# EAGLE schematic carl ripup  2v42 (EAGLE 7.4.0)
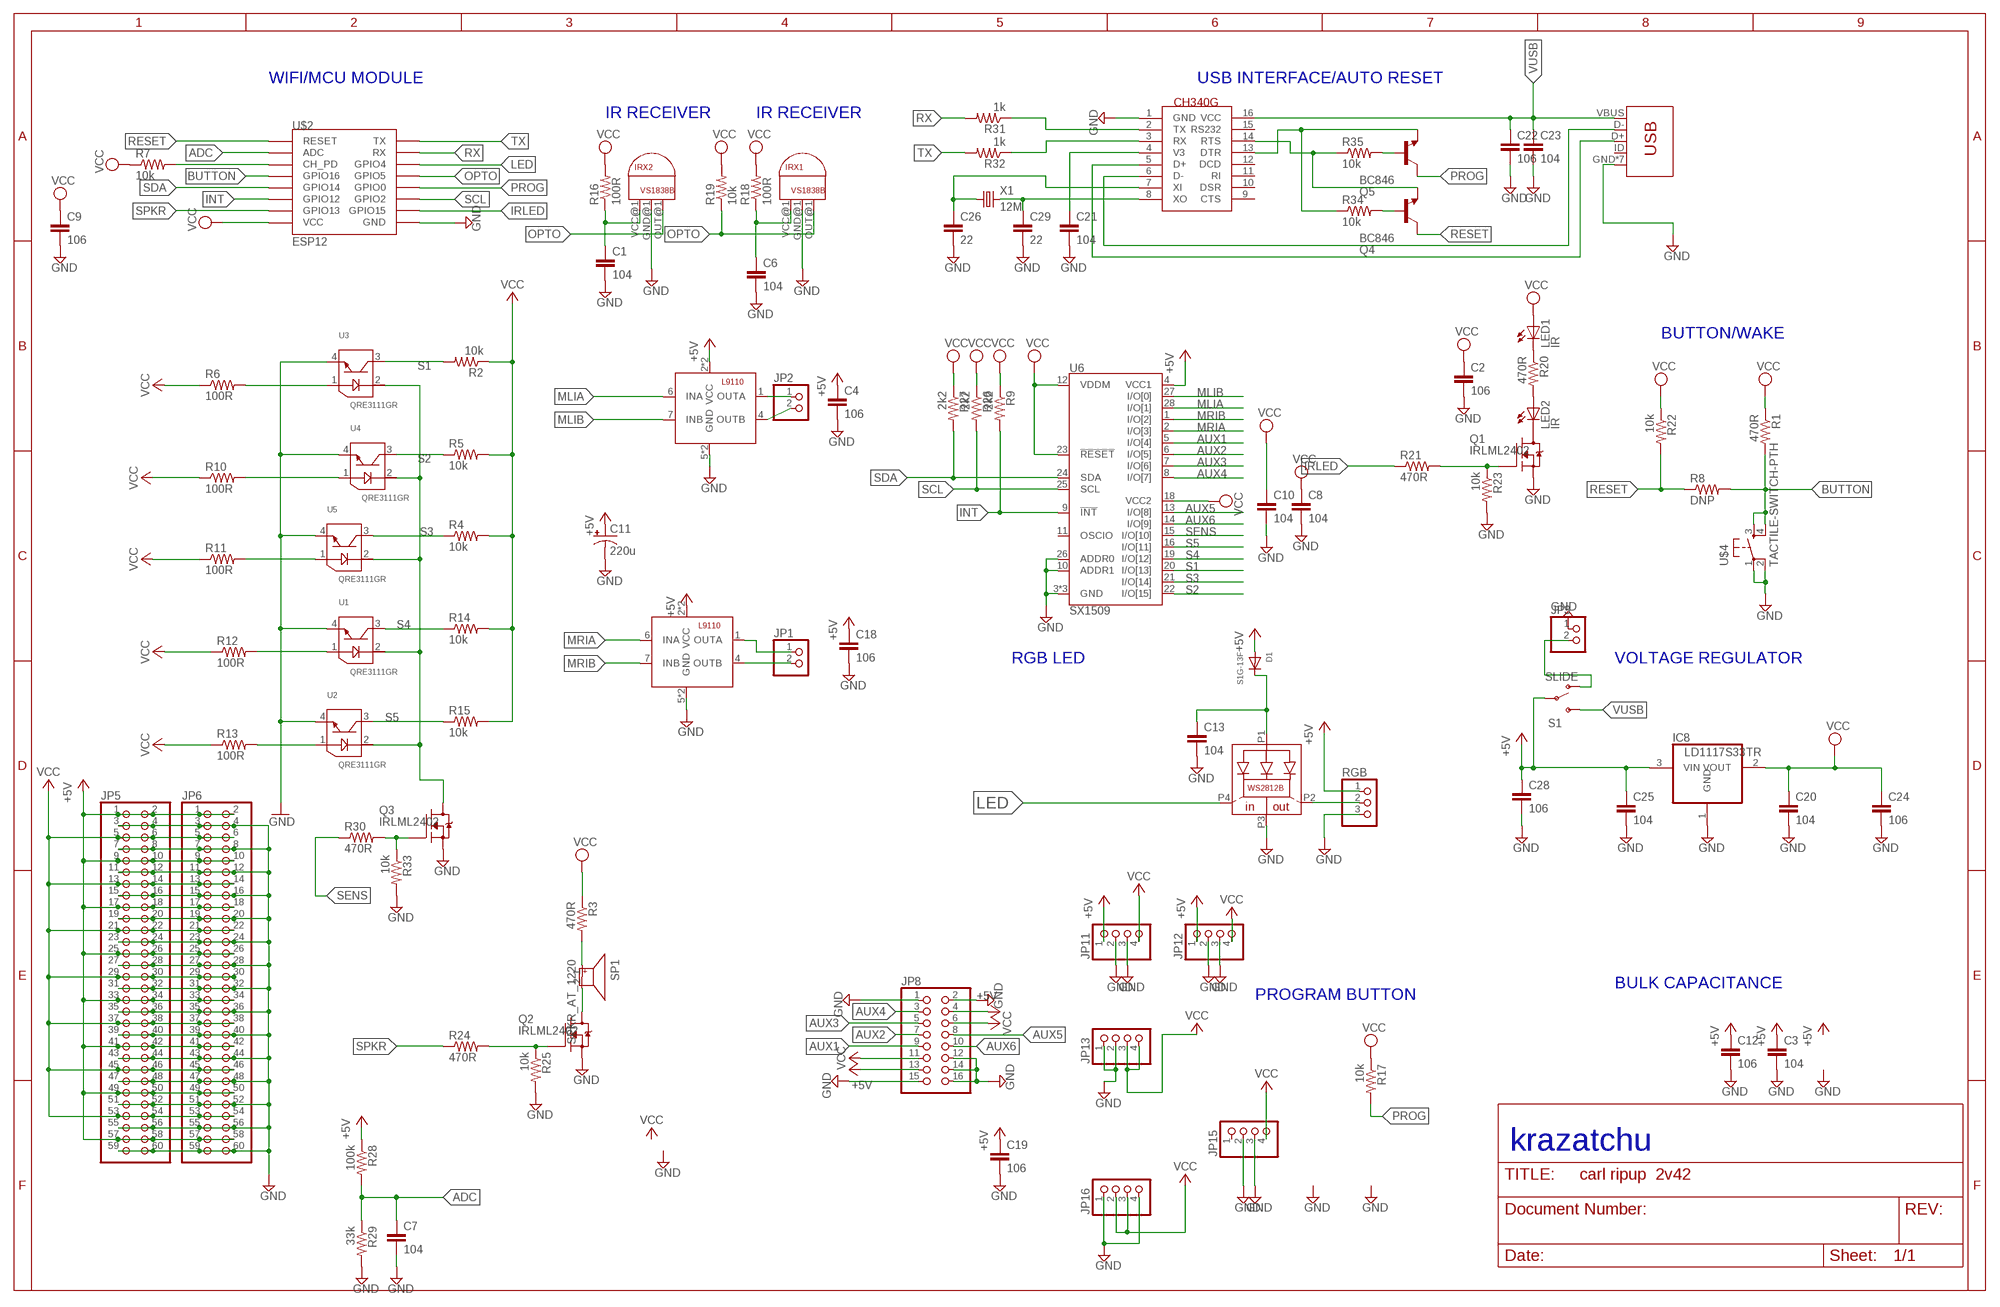
[diagram p0: schematic, sheet 1]

## Parts
C1  104  C-EUC0805  [C0805]
C2  106  C-EUC0805  [C0805]
C3  104  C-EUC0805  [C0805]
C4  106  C-EUC0805  [C0805]
C6  104  C-EUC0805  [C0805]
C7  104  C-EUC0805  [C0805]
C8  104  C-EUC0805  [C0805]
C9  106  C-EUC0805  [C0805]
C10  104  C-EUC0805  [C0805]
C11  220u  CPOL-US140CLH-0810  [140CLH-0810]
C12  106  C-EUC0805  [C0805]
C13  104  C-EUC0805  [C0805]
C18  106  C-EUC0805  [C0805]
C19  106  C-EUC0805  [C0805]
C20  104  C-EUC0805  [C0805]
C21  104  C-EUC0805  [C0805]
C22  106  C-EUC0805  [C0805]
C23  104  C-EUC0805  [C0805]
C24  106  C-EUC0805  [C0805]
C25  104  C-EUC0805  [C0805]
C26  22  C-EUC0805  [C0805]
C28  106  C-EUC0805  [C0805]
C29  22  C-EUC0805  [C0805]
D1  S1G-13F  DIODESMA  [SMADIODE]
IC1  L9110  [SOIC8]
IC2  L9110  [SOIC8]
IC8  LD1117S33TR  REG1117  [SOT223]
IRX1  VS1838B  IR-RX  [IR-RX-SINGLE]
IRX2  VS1838B  IR-RX  [IR-RX-SINGLE]
JP1  PINHD-1X2  [1X02]
JP2  PINHD-1X2  [1X02]
JP3  PINHD-1X2  [1X02]
JP5  PINHD-2X30  [2X30]
JP6  PINHD-2X30  [2X30]
JP8  PINHD-2X8  [2X08]
JP11  PINHD-1X4  [1X04]
JP12  PINHD-1X4  [1X04]
JP13  PINHD-1X4  [1X04]
JP15  PINHD-1X4  [1X04]
JP16  PINHD-1X4  [1X04]
LED1  IR  LED5MM  [LED5MM]
LED2  IR  LED5MM  [LED5MM]
Q1  IRLML2402  [SOT23]
Q2  IRLML2402  [SOT23]
Q3  IRLML2402  [SOT23]
Q4  BC846  [SOT23]
Q5  BC846  [SOT23]
R1  470R  R-US_R0805  [R0805]
R2  10k  R-US_R0805  [R0805]
R3  470R  R-US_R0805  [R0805]
R4  10k  R-US_R0805  [R0805]
R5  10k  R-US_R0805  [R0805]
R6  100R  R-US_R0805  [R0805]
R7  10k  R-US_R0805  [R0805]
R8  DNP  R-US_R0805  [R0805]
R9  2k2  R-US_R0805  [R0805]
R10  100R  R-US_R0805  [R0805]
R11  100R  R-US_R0805  [R0805]
R12  100R  R-US_R0805  [R0805]
R13  100R  R-US_R0805  [R0805]
R14  10k  R-US_R0805  [R0805]
R15  10k  R-US_R0805  [R0805]
R16  100R  R-US_R0805  [R0805]
R17  10k  R-US_R0805  [R0805]
R18  100R  R-US_R0805  [R0805]
R19  10k  R-US_R0805  [R0805]
R20  470R  R-US_R0805  [R0805]
R21  470R  R-US_R0805  [R0805]
R22  10k  R-US_R0805  [R0805]
R23  10k  R-US_R0805  [R0805]
R24  470R  R-US_R0805  [R0805]
R25  10k  R-US_R0805  [R0805]
R26  2k2  R-US_R0805  [R0805]
R27  2k2  R-US_R0805  [R0805]
R28  100k  R-US_R0805  [R0805]
R29  33k  R-US_R0805  [R0805]
R30  470R  R-US_R0805  [R0805]
R31  1k  R-US_R0805  [R0805]
R32  1k  R-US_R0805  [R0805]
R33  10k  R-US_R0805  [R0805]
R34  10k  R-US_R0805  [R0805]
R35  10k  R-US_R0805  [R0805]
RGB  PINHD-1X3RND  [1X03_ROUND]
RGB1  ws2812b  WS2812B  [PLCC_4_5050_TRIM]
S1  SLIDE  SWITCH-SPDTPTH  [SWITCH-SPDT]
SP1  SPKR_AT_1220  [TRANSDUCER_12/6]
U1  QRE3111GR  [QRE1113GR]
U2  QRE3111GR  [QRE1113GR]
U3  QRE3111GR  [QRE1113GR]
U4  QRE3111GR  [QRE1113GR]
U5  QRE3111GR  [QRE1113GR]
U6  SX1509  [QFN-28]
U$2  ESP12  [ESP12]
U$4  TACTILE-SWITCH-PTH  [TAC-SWITCH-PTH]
U$5  CH340G  [SOIC16]
USB1  USB_MICROB-10118194-0001LF  [USB-MICRO-B]
X1  12M  CRYSTALHC49UP  [HC49UP]

## Nets
+5V: C3.1 C4.1 C11.+ C12.1 C18.1 C19.1 C25.1 C28.1 D1.A IC1.2(VCC) IC1.3(VCC) IC2.2(VCC) IC2.3(VCC) IC8.3(VIN) JP5.1 JP5.2 JP5.9 JP5.10 JP5.17 JP5.18 JP5.25 JP5.26 JP5.33 JP5.34 JP5.41 JP5.42 JP5.49 JP5.50 JP5.57 JP5.58 JP6.1 JP6.2 JP6.9 JP6.10 JP6.17 JP6.18 JP6.25 JP6.26 JP6.33 JP6.34 JP6.41 JP6.42 JP6.49 JP6.50 JP6.57 JP6.58 JP8.4 JP8.13 JP11.1 JP12.1 R28.1 RGB.1 S1.2(P) U6.4(VCC1)
ADC: C7.1 R28.2 R29.1 U$2.ADC
AUX1: JP8.9 U6.5(I/O[4])
AUX2: JP8.7 U6.6(I/O[5])
AUX3: JP8.5 U6.7(I/O[6])
AUX4: JP8.3 U6.8(I/O[7])
AUX5: JP8.8 U6.13(I/O[8])
AUX6: JP8.10 U6.14(I/O[9])
BUTTON: R1.2 R8.2 U$2.GPIO16 U$4.3 U$4.4
GND: C1.2 C2.2 C3.2 C4.2 C6.2 C7.2 C8.2 C9.2 C10.2 C11.- C12.2 C13.2 C18.2 C19.2 C20.2 C21.2 C22.2 C23.2 C24.2 C25.2 C26.2 C28.2 C29.2 IC1.5(GND) IC1.8(GND) IC2.5(GND) IC2.8(GND) IC8.1(GND) IRX1.GND@1(GND) IRX2.GND@1(GND) JP3.1 JP5.3 JP5.4 JP5.7 JP5.8 JP5.11 JP5.12 JP5.15 JP5.16 JP5.19 JP5.20 JP5.23 JP5.24 JP5.27 JP5.28 JP5.31 JP5.32 JP5.35 JP5.36 JP5.39 JP5.40 JP5.43 JP5.44 JP5.47 JP5.48 JP5.51 JP5.52 JP5.55 JP5.56 JP5.59 JP5.60 JP6.3 JP6.4 JP6.7 JP6.8 JP6.11 JP6.12 JP6.15 JP6.16 JP6.19 JP6.20 JP6.23 JP6.24 JP6.27 JP6.28 JP6.31 JP6.32 JP6.35 JP6.36 JP6.39 JP6.40 JP6.43 JP6.44 JP6.47 JP6.48 JP6.51 JP6.52 JP6.55 JP6.56 JP6.59 JP6.60 JP8.1 JP8.2 JP8.12 JP8.14 JP8.15 JP8.16 JP11.2 JP11.3 JP12.2 JP12.3 JP13.1 JP13.2 JP15.2 JP15.3 JP16.1 JP16.4 Q1.2(S) Q2.2(S) Q3.2(S) R23.2 R25.2 R29.2 R33.2 RGB1.P3(GND) RGB.3 U1.4 U2.4 U3.4 U4.4 U5.4 U6.3(GND) U6.10(ADDR1) U6.17(GND) U6.26(ADDR0) U6.29(GND) U$2.GND U$4.1 U$4.2 U$5.1(GND) USB1.GND USB1.MT1(GND) USB1.MT2(GND) USB1.MT3(GND) USB1.MT4(GND) USB1.SMT3(GND) USB1.SMT4(GND)
INT: R9.2 U6.9(!INT) U$2.GPIO12
IRLED: R21.1 U$2.GPIO15
LED: RGB1.P4(DI) U$2.GPIO4
MLIA: IC1.6(INA) U6.28(I/O[1])
MLIB: IC1.7(INB) U6.27(I/O[0])
MRIA: IC2.6(INA) U6.2(I/O[3])
MRIB: IC2.7(INB) U6.1(I/O[2])
N$1: R7.2 U$2.CH_PD
N$2: R6.2 U3.1
N$3: C1.1 IRX2.VCC@1(VCC) R16.1
N$4: C13.1 D1.C RGB1.P1(LEDVDD)
N$5: R3.2 SP1.1
N$6: Q3.3(D) U1.2 U2.2 U3.2 U4.2 U5.2
N$7: Q2.3(D) SP1.2
N$8: Q3.1(G) R30.2 R33.1
N$9: IC2.4(OUTB) JP1.2
N$11: R10.2 U4.1
N$12: R11.2 U5.1
N$13: R13.2 U2.1
N$14: R12.2 U1.1
N$15: IC2.1(OUTA) JP1.1
N$16: JP3.2 S1.1(O)
N$17: LED1.K(C) R20.1
N$22: Q2.1(G) R24.2 R25.1
N$30: C6.1 IRX1.VCC@1(VCC) R18.1
N$31: IC1.1(OUTA) JP2.1
N$32: IC1.4(OUTB) JP2.2
N$33: RGB1.P2(DO) RGB.2
N$34: LED2.A R20.2
N$35: LED2.K(C) Q1.3(D)
N$36: Q1.1(G) R21.2 R23.1
N$39: U$5.6(D-) USB1.D-
N$40: U$5.5(D+) USB1.D+
N$41: C26.1 U$5.7(XI) X1.1
N$42: C29.1 U$5.8(XO) X1.2
N$43: C21.1 U$5.4(V3)
N$44: R31.1 U$5.2(TX)
N$45: R32.1 U$5.3(RX)
N$46: Q4.2(E) R35.1 U$5.14(RTS)
N$47: Q4.1(B) R34.2
N$48: Q5.1(B) R35.2
N$50: Q5.2(E) R34.1 U$5.13(DTR)
OPTO: IRX1.OUT@1(OUT) IRX2.OUT@1(OUT) R19.1 U$2.GPIO5
PROG: Q5.3(C) R17.2 U$2.GPIO0
RESET: Q4.3(C) R8.1 R22.2 U$2.RESET
RX: R31.2 U$2.RX
S1: R2.2 U3.3 U6.20(I/O[13])
S2: R5.1 U4.3 U6.22(I/O[15])
S3: R4.1 U5.3 U6.21(I/O[14])
S4: R14.1 U1.3 U6.19(I/O[12])
S5: R15.1 U2.3 U6.16(I/O[11])
SCL: R26.2 U6.25(SCL) U$2.GPIO2
SDA: R27.2 U6.24(SDA) U$2.GPIO14
SENS: R30.1 U6.15(I/O[10])
SPKR: R24.1 U$2.GPIO13
TX: R32.2 U$2.TX
VCC: C2.1 C8.1 C9.1 C10.1 C20.1 C24.1 IC8.2(VOUT) JP5.5 JP5.6 JP5.13 JP5.14 JP5.21 JP5.22 JP5.29 JP5.30 JP5.37 JP5.38 JP5.45 JP5.46 JP5.53 JP5.54 JP6.5 JP6.6 JP6.13 JP6.14 JP6.21 JP6.22 JP6.29 JP6.30 JP6.37 JP6.38 JP6.45 JP6.46 JP6.53 JP6.54 JP8.6 JP8.11 JP11.4 JP12.4 JP13.3 JP13.4 JP15.4 JP16.2 JP16.3 LED1.A R1.1 R2.1 R3.1 R4.2 R5.2 R6.1 R7.1 R9.1 R10.1 R11.1 R12.1 R13.1 R14.2 R15.2 R16.2 R17.1 R18.2 R19.2 R22.1 R26.1 R27.1 U6.12(VDDM) U6.18(VCC2) U6.23(!RESET) U$2.VCC
VUSB: C22.1 C23.1 S1.3(S) U$5.16(VCC) USB1.VBUS
Unconnected: JP15.1 U6.11(OSCIO) U$5.9(CTS) U$5.10(DSR) U$5.11(RI) U$5.12(DCD) U$5.15(RS232) USB1.ID

## Notes on the sheet
- WIFI/MCU MODULE | USB INTERFACE/AUTO RESET
- IR RECEIVER | IR RECEIVER
- BUTTON/WAKE
- RGB LED | VOLTAGE REGULATOR
- BULK CAPACITANCE
- PROGRAM BUTTON
- krazatchu

## Library data of the parts
C1-C4 C6-C10 C12 C13 C18-C26 C28 C29 = rcl:C-EU: CAPACITOR, European symbol
C11 = rcl:CPOL-US: POLARIZED CAPACITOR, American symbol
D1 = adafruit:DIODE: Diode SMADIODE - SMA Surface Mount Package 20V 1A Schottky Diode Digikey: 641-1014-6-ND DO-1N4148 - Through Hole Small Current Diode SOD-123 20V 1 A (.5mV Vf) Schottky Diode - Digikey: MBRX120TPMSCT-ND SOD-323 10V 570mA (.38mV Vf, 3ns) Schottky Diode - Digikey: ZLLS410CT-ND SOD-523 30V 30mA Schottky Diode (RB751S-40TE61) - Digikey: RB751S-40TE61CT-ND SOT23-R/W - SOT23 Package (R = Solder Paste/Reflow Ovens, W = Hand-Soldering) BAT54Film 40V 300mA - Digikey: 497-7162-1-ND
IC1 IC2 = KDS krazatchu:L9110
IC8 = burr-brown:REG1117: 800mA and 1A Low Dropout (LDO) Positive Regulator 1.8V, 2.5V, 2.85V, 3.3V, 5V, and Adj; MPN: REG1117; OC_FARNELL: 1097566; OC_NEWARK: 14P6981
IRX1 IRX2 = KDS krazatchu:IR-RX
JP1-JP3 = pinhead:PINHD-1X2: PIN HEADER
JP5 JP6 = pinhead:PINHD-2X30: PIN HEADER
JP8 = pinhead:PINHD-2X8: PIN HEADER
JP11-JP13 JP15 JP16 = pinhead:PINHD-1X4: PIN HEADER
LED1 LED2 = adafruit:LED: LED OSRAM: - CHIPLED LG R971, LG N971, LY N971, LG Q971, LY Q971, LO R971, LY R971 LH N974, LH R974 LS Q976, LO Q976, LY Q976 LO Q996 - Hyper CHIPLED LW Q18S LB Q993, LB Q99A, LB R99A - SideLED LS A670, LO A670, LY A670, LG A670, LP A670 LB A673, LV A673, LT A673, LW A673 LH A674 LY A675 LS A676, LA A676, LO A676, LY A676, LW A676 LS A679, LY A679, LG A679 - Hyper Micro SIDELED® LS Y876, LA Y876, LO Y876, LY Y876 LT Y87S - SmartLED LW L88C, LW L88S LB L89C, LB L89S, LG L890 LS L89K, LO L89K, LY L89K LS L896, LA L896, LO L896, LY L896 - TOPLED LS T670, LO T670, LY T670, LG T670, LP T670 LSG T670, LSP T670, LSY T670, LOP T670, LYG T670 LG T671, LOG T671, LSG T671 LB T673, LV T673, LT T673, LW T673 LH T674 LS T676, LA T676, LO T676, LY T676, LB T676, LH T676, LSB T676, LW T676 LB T67C, LV T67C, LT T67C, LS T67K, LO T67K, LY T67K, LW E67C LS E67B, LA E67B, LO E67B, LY E67B, LB E67C, LV E67C, LT E67C LW T67C LS T679, LY T679, LG T679 LS T770, LO T770, LY T770, LG T770, LP T770 LB T773, LV T773, LT T773, LW T773 LH T774 LS E675, LA E675, LY E675, LS T675 LS T776, LA T776, LO T776, LY T776, LB T776 LHGB T686 LT T68C, LB T68C - Hyper Mini TOPLED® LB M676 - Mini TOPLED Santana® LG M470 LS M47K, LO M47K, LY M47K Source: http://www.osram.convergy.de/
Q1-Q3 = KDS krazatchu:IRLML2402
Q4 Q5 = transistor:BC846: NPN TRANSISTOR
R1 R3 R7-R9 R16-R35 = rcl:R-US_: RESISTOR, American symbol
R2 R4-R6 R10-R15 = 1_Teaching:R-US_: RESISTOR, American symbol
RGB = pinhead:PINHD-1X3: PIN HEADER
RGB1 = KDS krazatchu:WS2812B
S1 = SparkFun-Electromechanical:SWITCH-SPDT: SPDT Switch Simple slide switch, Spark Fun Electronics SKU : COM-00102 DPDT SMT slide switch, AYZ0202, SWCH-08179; PROD_ID: SWCH-08261
SP1 = KDS krazatchu:SPKR_AT_1220
U1-U5 = 1_Teaching:QRE3111GR
U6 = SparkFun-DigitalIC:SX1509: Semtech SX1509 The SX1509 is a complete ultra low voltage 1.2V to 3.6V General Purpose parallel Input/Output (GPIO) expanders ideal for low power handheld battery powered equipment. This version comes in a 16-channel configuration and allows easy serial expansion of I/O through a standard 400kHz I2C interface. GPIO devices can provide additional control and monitoring when the microcontroller or chipset has insufficient I/O ports, or in systems where serial communication and control from a remote location is advantageous.
U$2 = esp8266modules:ESP12: ESP8266 Wifi module 12
U$4 = GeekAmmo:TACTILE-SWITCH: Tactile Switch 4 Pins, SPST NO
U$5 = usb-serial:CH340G
USB1 = KDS krazatchu:USB_MICROB-10118194-0001LF
X1 = crystal:CRYSTAL: CRYSTAL; OC_FARNELL: unknown; OC_NEWARK: unknown